# Altium schematic sheet led_phototransistor.SchDoc
size A4; SheetNumber: 5; SheetTotal: 9
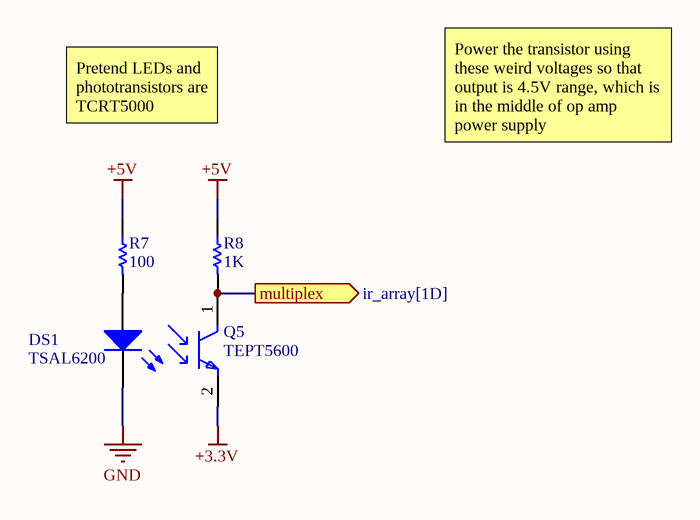
[diagram p0: led_phototransistor.SchDoc]

## Parts
DS1  TSAL6200  [VISH-TSAL6200]
Q5  TEPT5600  [FP-6_544-5185_03-4-MFG]
R7  value 100  (hidden comment: Resistor)
R8  value 1K  (hidden comment: Resistor)

## Ports
multiplex (out, see ir_array[1D])

## Nets
+3.3V: Q5.2(E)
+5V: R7.1 R8.1
GND: DS1.2(K)
multiplex: Q5.1(C) R8.2 ; port multiplex
NetDS1_1: DS1.1(A) R7.2

## Notes on the sheet
- Pretend LEDs and phototransistors are TCRT5000
- Power the transistor using these weird voltages so that output is 4.5V range, which is in the middle of op amp power supply

## Library data of the parts
DS1 = CMP-2000-07327-1: High Power Infrared Emitting Diode, GaAlAs, MQW, 1.35 V, 100 mA, -40 to 85 degC, 2-Pin THD, RoHS, Bulk; Manufacturer: Vishay; Lum Intensity: 500mW/srmcd; Product Depth (mm): 5.8mm; Type: IrLED; Luminous Intensity: 500mW/sr; Forward Voltage: 3V; Shape Type: Circular; Peak Wavelength: 950nm; Rad Hardened: No; Product Height (mm): 8.7mm; Number of  Elements: 1; Forward Current: 100mA; High Brightness: Yes; Reverse Voltage: 5V; DELETED: Compliant; Power Dissipation: 160W; Viewing Angle: 34deg; Lens Type: Colored; Packaging: Bulk; Lens Dimensions: 5x5x7.7mm; Package Reference: TSAL6200; Chip Material: GaAlAs; Package Description: 2-Pin Through Hole Device, Dia 5.8 mm, Pitch 2.54 mm; Main Category: IrLED; Manufacturer URL: http://www.vishay.com/; Product Length (mm): 5.8mm; Datasheet URL: http://www.vishay.com/docs/81010/tsal6200.pdf; Operating Temperature Classification: Industrial; Package Type: T-13/4; Pin Count: 2; Mounting: ThroughHole; Mounting Technology: ThroughHole; Test Current (It): 100mA; Datasheet Version: Rev. 2.4, 03/2014; Operating Temp Range: -40Cto85C
Q5 = CMP-02533-000004-1: SENSOR PHOTO 570NM TOP VIEW RAD; Number of Channels: 1; Collector Emitter Voltage (VCEO): 6V; Output Type: Analog; Power Consumption: 100mW; Max Collector Current: 20mA; Lens Style: Domed; Polarity: NPN; Dark Current: 50nA; Viewing Angle: 20°; Operating Supply Voltage: 5V; Package Material: SILICON; Wavelength: 570nm; Width: 5.75mm; Power Dissipation: 100mW; Package Quantity: 4000; Radiation Hardening: No; RoHS Compliant: Yes; Lead Free: Lead Free; Max Power Dissipation: 100mW; Max Operating Temperature: 85°C; Length: 5.75mm; Case/Package: Radial; Number of Elements: 1; Number of Pins: 2; Min Operating Temperature: -40°C; Mount: Through Hole; Height: 8mm; Orientation: Top View; Series: -; Collector Emitter Breakdown Voltage: 6V; Packaging: Bulk
R7 R8 = Resistor: TC1: 0; SimulationGenericComponent: True; TC2: 0